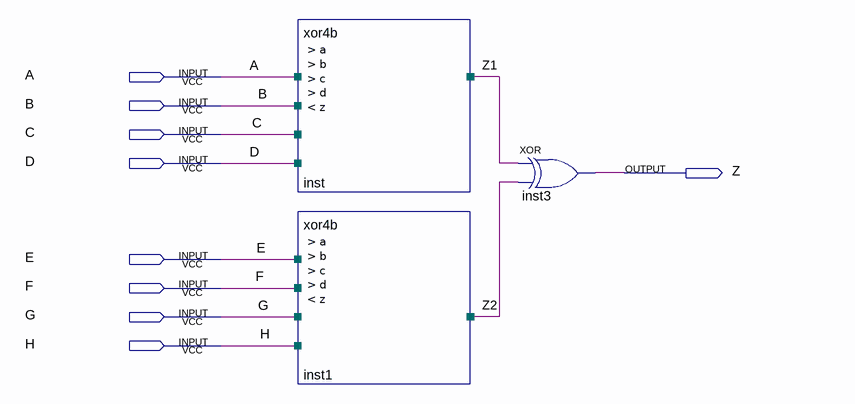
[diagram p0: schematic sheet]
// Quartus schematic xor8b.bdf as structural Verilog: 3 symbols, 9 pins
module xor8b (
  input  A,
  input  B,
  input  C,
  input  D,
  input  E,
  input  F,
  input  G,
  input  H,
  output Z
);

  wire Z1, Z2;

  xor4b inst (.a(A), .b(B), .c(C), .d(D), .z(Z1));
  xor4b inst1 (.a(E), .b(F), .c(G), .d(H), .z(Z2));
  xor inst3 (Z, Z1, Z2);
endmodule
